# Altium schematic sheet esp8266.schdoc
size 264 x 219 mm
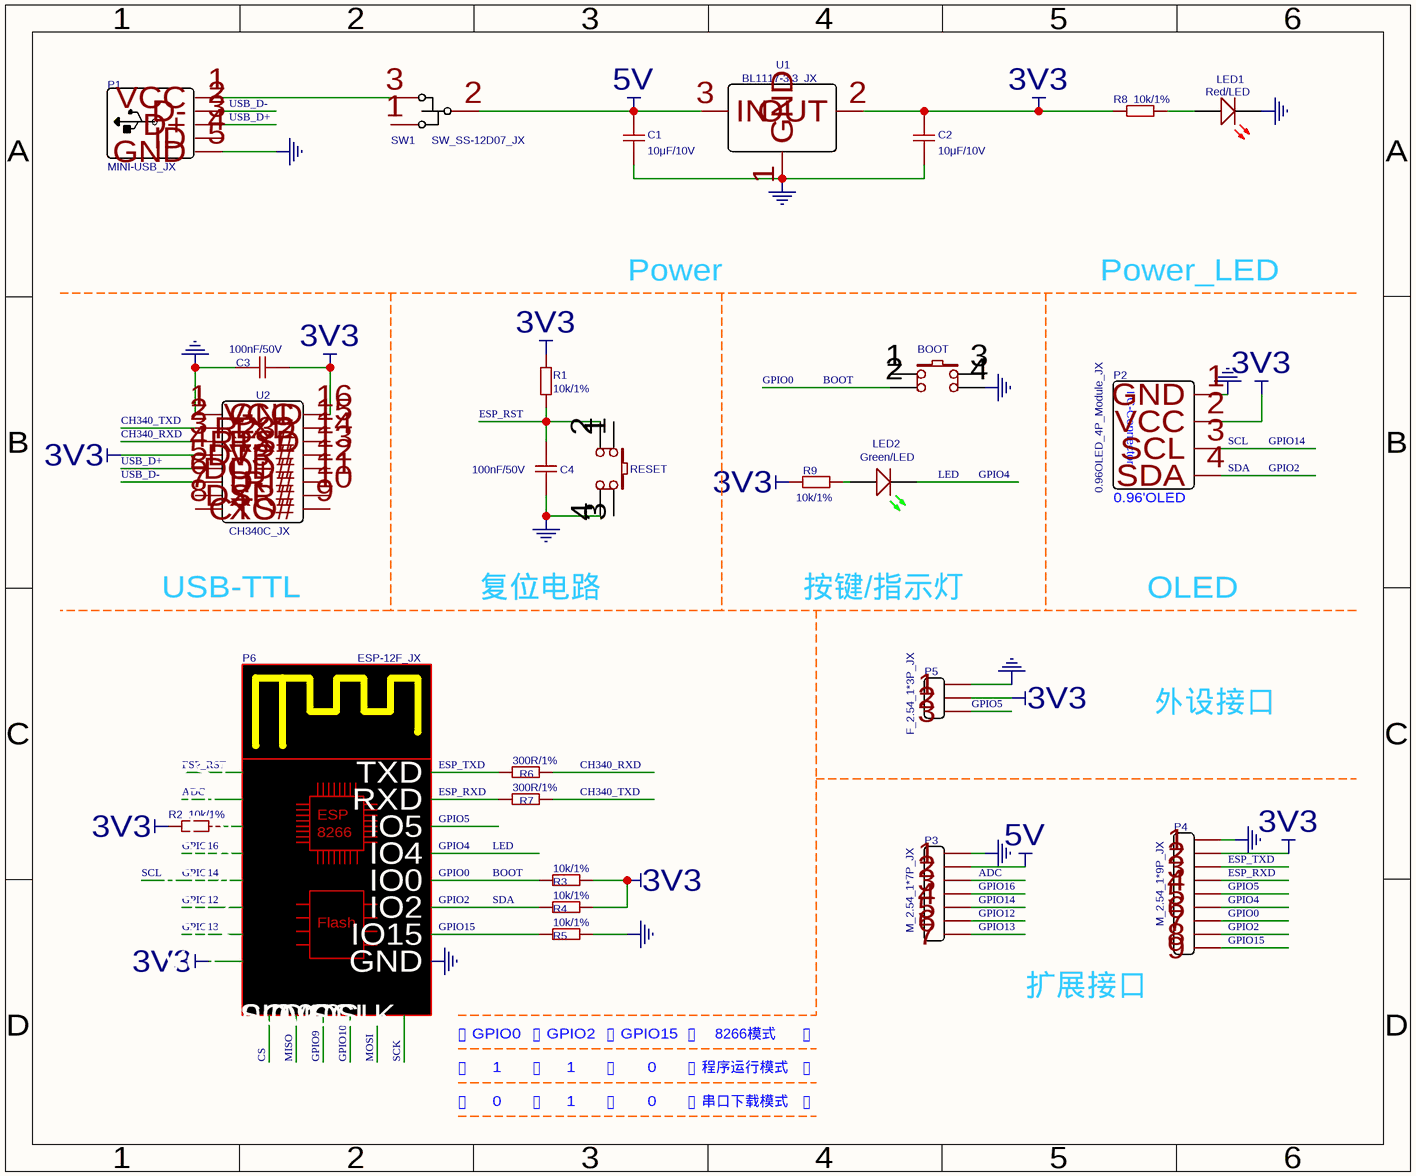
[diagram p0: esp8266.schdoc]

## Parts
BOOT  SW_PUSH_JX  [SW_PUSH_6MM_H5MM_JX]  (value not drawn)
C1  10μF/10V  [0603_C_JX]
C2  10μF/10V  [0603_C_JX]
C3  100nF/50V  [0603_C_JX]
C4  100nF/50V  [0603_C_JX]
LED1  Red/LED  [0603_D_JX]
LED2  Green/LED  [0603_D_JX]
P1  MINI-USB_JX  [USB_MINI_B_FE_JX]
P2  0.96OLED_4P_Module_JX  [0.96OLED_4P_MODULE_JX]
P3  M_2.54_1*7P_JX  [M_2.54_1*7P_JX]
P4  M_2.54_1*9P_JX  [M_2.54_1*9P_JX]
P5  F_2.54_1*3P_JX  [M_2.54_1*3P_JX]
P6  ESP-12F_JX  [ESP-12F_JX]
R1  10k/1%  [0603_R_JX]
R2  10k/1%  [0603_R_JX]
R3  10k/1%  [0603_R_JX]
R4  10k/1%  [0603_R_JX]
R5  10k/1%  [0603_R_JX]
R6  300R/1%  [0603_R_JX]
R7  300R/1%  [0603_R_JX]
R8  10k/1%  [0603_R_JX]
R9  10k/1%  [0603_R_JX]
RESET  SW_PUSH_JX  [SW_PUSH_6MM_H5MM_JX]  (value not drawn)
SW1  SW_SS-12D07_JX  [SW_SS-12D07_JX]
U1  BL1117-3.3_JX  [SOT223_JX]
U2  CH340C_JX  [SOP16_150MIL_JX]

## Nets
3V3: C2.2 C3.2 P2.2(VCC) P4.2 P5.2 P6.8(VCC) R1.1 R2.2 R3.2 R4.1 R8.2 R9.2 U1.2(OUT) U2.4(V3) U2.16(VCC)
5V: C1.2 P3.2 SW1.2 U1.3(IN)
GND: BOOT.4 C1.1 C2.1 C3.1 C4.1 LED1.2(C) P1.5(GND) P2.1(GND) P3.1 P4.1 P5.1 P6.15(GND) R5.1 RESET.4 U1.1(GND) U2.1(GND)
ADC: P3.3 P6.2(ADC)
BOOT: BOOT.2 P4.7 P6.18(IO0) R3.1  [also labelled GPIO0]
CH340_RXD: R6.1 U2.3(RXD)
CH340_TXD: R7.1 U2.2(TXD)
CS: P6.9(CS0)
ESP_RST: C4.2 P6.1(RST) R1.2 RESET.2
ESP_RXD: P4.4 P6.21(RXD) R7.2
ESP_TXD: P4.3 P6.22(TXD) R6.2
GPIO2: P2.4(SDA) P4.8 P6.17(IO2) R4.2  [also labelled SDA]
GPIO4: LED2.2(C) P4.6 P6.19(IO4)  [also labelled LED]
GPIO5: P4.5 P5.3 P6.20(IO5)
GPIO9: P6.11(IO9)
GPIO10: P6.12(IO10)
GPIO12: P3.6 P6.6(IO12)
GPIO13: P3.7 P6.7(IO13)
GPIO14: P2.3(SCL) P3.5 P6.5(IO14)  [also labelled SCL]
GPIO15: P4.9 P6.16(IO15) R5.2
GPIO16: P3.4 P6.4(IO16)
MISO: P6.10(MISO)
MOSI: P6.13(MOSI)
SCK: P6.14(SCLK)
USB_D+: P1.3(D+) U2.5(D+)
USB_D-: P1.2(D-) U2.6(D-)
NetLED1_1: LED1.1(A) R8.1
NetLED2_1: LED2.1(A) R9.1
NetP1_1: P1.1(VCC) SW1.3
NetP6_3: P6.3(EN) R2.1

Not connected (* = marked no-connect by the designer): BOOT 1 3; P1 4(ID); RESET 1 3; SW1 1; U2 7(XI) 8(XO) 9(CTS#) 10(DSR#) 11(RI#) 12(DCD#) 13(DTR#) 14(RTS#) 15(R232)

## Notes on the sheet
- Power
- Power_LED
- USB-TTL
- 复位电路
- 按键/指示灯
- OLED
- 外设接口
- (near P6) 
- (near P6) GPIO0
- 
- GPIO2
- GPIO15
- 8266模式
- 扩展接口
- 1
- 0
- 程序运行模式
- 串口下载模式
- (in symbol 0.96OLED_4P_Module_JX) IIC-Connector; 0.96'OLED
- (in symbol ESP-12F_JX) ESP; 8266; Flash

## Library data of the parts
C1 C2 = 10μF/10V: nameAlias: Value(F); spicePre: C; spiceSymbolName: Capacitor; BOM_Supplier: LCSC
C3 C4 = 100nF/50V: nameAlias: Value(F); spicePre: C; spiceSymbolName: Capacitor; BOM_Supplier: LCSC
P1 = MINI-USB_JX: Contributor: jixin-team; spicePre: P
R1-R5 R8 R9 = 10k/1%: nameAlias: Value(Ω); spicePre: R; spiceSymbolName: Resistor; BOM_Supplier: LCSC
R6 R7 = 300R/1%: nameAlias: Value(Ω); spicePre: R; spiceSymbolName: Resistor
SW1 = SW_SS-12D07_JX: Contributor: jixin-team; spicePre: S
U1 = BL1117-3.3_JX: Contributor: jixin002; spicePre: U
BOOT RESET = SW_PUSH_JX: BOM_Supplier: LCSC; spicePre: S
LED1 = Red/LED: BOM_Supplier: LCSC; spicePre: L
LED2 = Green/LED: spicePre: L
P2 = 0.96OLED_4P_Module_JX: spicePre: P
P3 = M_2.54_1*7P_JX: BOM_Supplier: LCSC; spicePre: P
P4 = M_2.54_1*9P_JX: BOM_Supplier: LCSC; spicePre: P
P5 = F_2.54_1*3P_JX: BOM_Supplier: LCSC; spicePre: P
P6 = ESP-12F_JX: spicePre: U
U2 = CH340C_JX: timeStamp: 1468327462; BOM_Supplier: LCSC; spicePre: U